# Altium schematic sheet DS3231.SchDoc
size A4
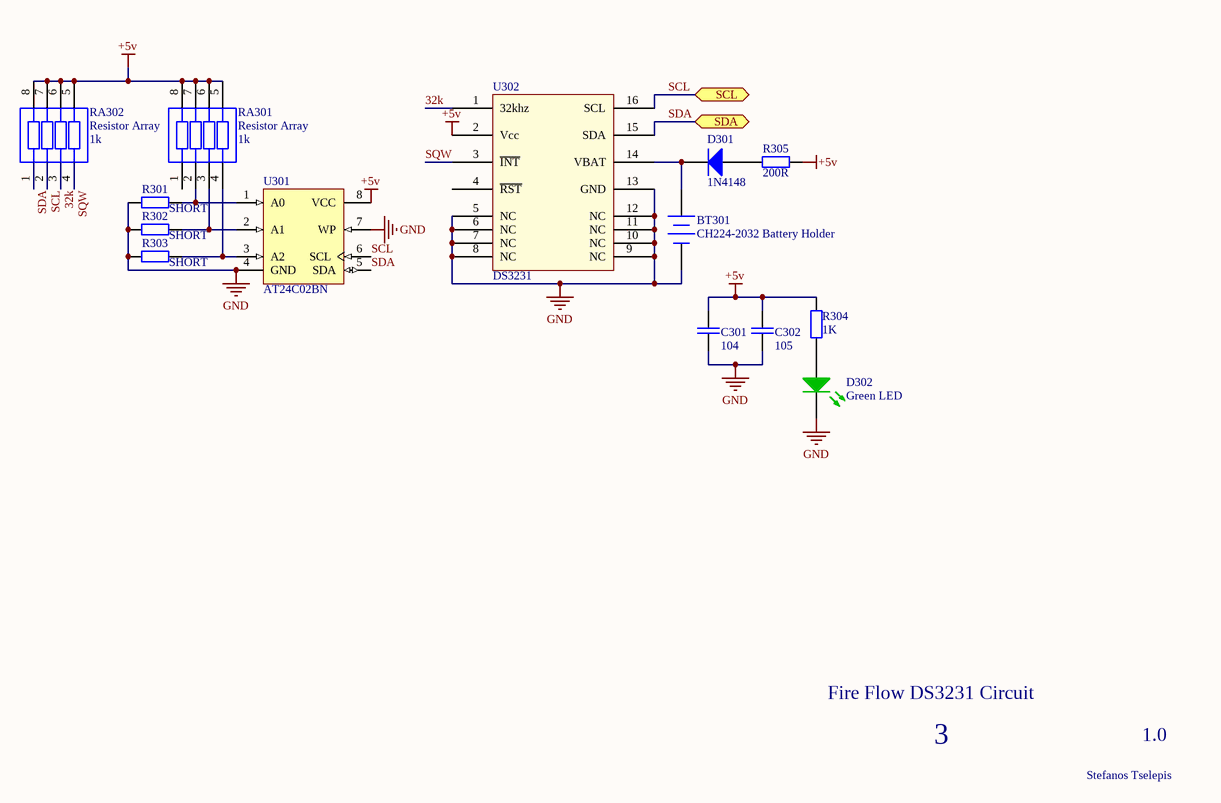
[diagram p0: DS3231.SchDoc]

## Parts
BT301  CH224-2032 Battery Holder  [CH224-2032 Battery Holder]
C301  104  [CC2013-0805]
C302  105  [CC2013-0805]
D301  1N4148  [CD2012-0805]
D302  Green LED  [CD3216-1206]
R301  SHORT  [CR2012-0805]
R302  SHORT  [CR2012-0805]
R303  SHORT  [CR2012-0805]
R304  1K  [CR2012-0805]
R305  200R  [CR2012-0805]
RA301  Resistor Array  value 1k  [EXB38V]
RA302  Resistor Array  value 1k  [EXB38V]
U301  AT24C02BN  [S8]
U302  DS3231  [SO-G16/D10.4]

## Ports
SCL, SDA

## Nets
+5v: C301.1 C302.1 R304.1 R305.2 RA301.5 RA301.6 RA301.7 RA301.8 RA302.5 RA302.6 RA302.7 RA302.8 U301.8(VCC) U302.2(Vcc)
GND: BT301.2(-) C301.2 C302.2 D302.2(K) R301.2 R302.2 R303.2 U301.4(GND) U301.7(WP) U302.5(NC) U302.6(NC) U302.7(NC) U302.8(NC) U302.9(NC) U302.10(NC) U302.11(NC) U302.12(NC) U302.13(GND)
32k: RA302.3 U302.1(32khz)
SCL: RA302.2 U301.6(SCL) U302.16(SCL) ; port SCL
SDA: RA302.1 U301.5(SDA) U302.15(SDA) ; port SDA
SQW: RA302.4 U302.3(~{INT})
NetBT301_1: BT301.1(+) D301.K U302.14(VBAT)
NetD301_A: D301.A R305.1
NetD302_1: D302.1(A) R304.2
NetR301_1: R301.1 RA301.2 U301.1(A0)
NetR302_1: R302.1 RA301.3 U301.2(A1)
NetR303_1: R303.1 RA301.4 U301.3(A2)

Not connected (* = marked no-connect by the designer): RA301 1; U302 4(~{RST})

## Notes on the sheet
- Fire Flow DS3231 Circuit
- 3
- 1.0
- Stefanos Tselepis

## Library data of the parts
BT301 = Battery: Multicell Battery
C301 C302 = Cap Metal Film
  C301: Value: 104
  C302: Value: 105
D301 = Diode: Value: 1N4148
D302 = LED: RED
R301-R305 = Resistor
  R301-R303: Value: SHORT
  R304: Value: 1K
  R305: Value: 200R
U301 = AT24C02BN-SP25-B: 2Kbit (256 x 8), 2-wire Bus Automotive Serial EEPROM with full memory Write Protect, 2.5V, 8-Pin SOIC, Bulk; Published: 20-Sep-2010; DatasheetVersion: 8517C,  Jan-2009; PackageVersion: revC, Mar-2005; PackageReference: 8S1; Publisher: Altium Limited; PackageDescription: 8-Lead (0.150" Wide Body), Plastic Gull Wing Small Outline (JEDEC SOIC); Code_JEDEC: MS-012-AA; Code_IPC: SOIC127P600-8; ComponentLink1Description: Manufacturer Link; ComponentLink1URL: http://www.atmel.com/products/serial/default.asp; ComponentLink2Description: Datasheet; ComponentLink2URL: http://www.atmel.com/dyn/resources/prod_documents/doc8517.pdf; ComponentLink3Description: Atmel.com Home; ComponentLink3URL: http://www.atmel.com